# Altium schematic sheet power.SchDoc
size A4; SheetNumber: 2; SheetTotal: 2
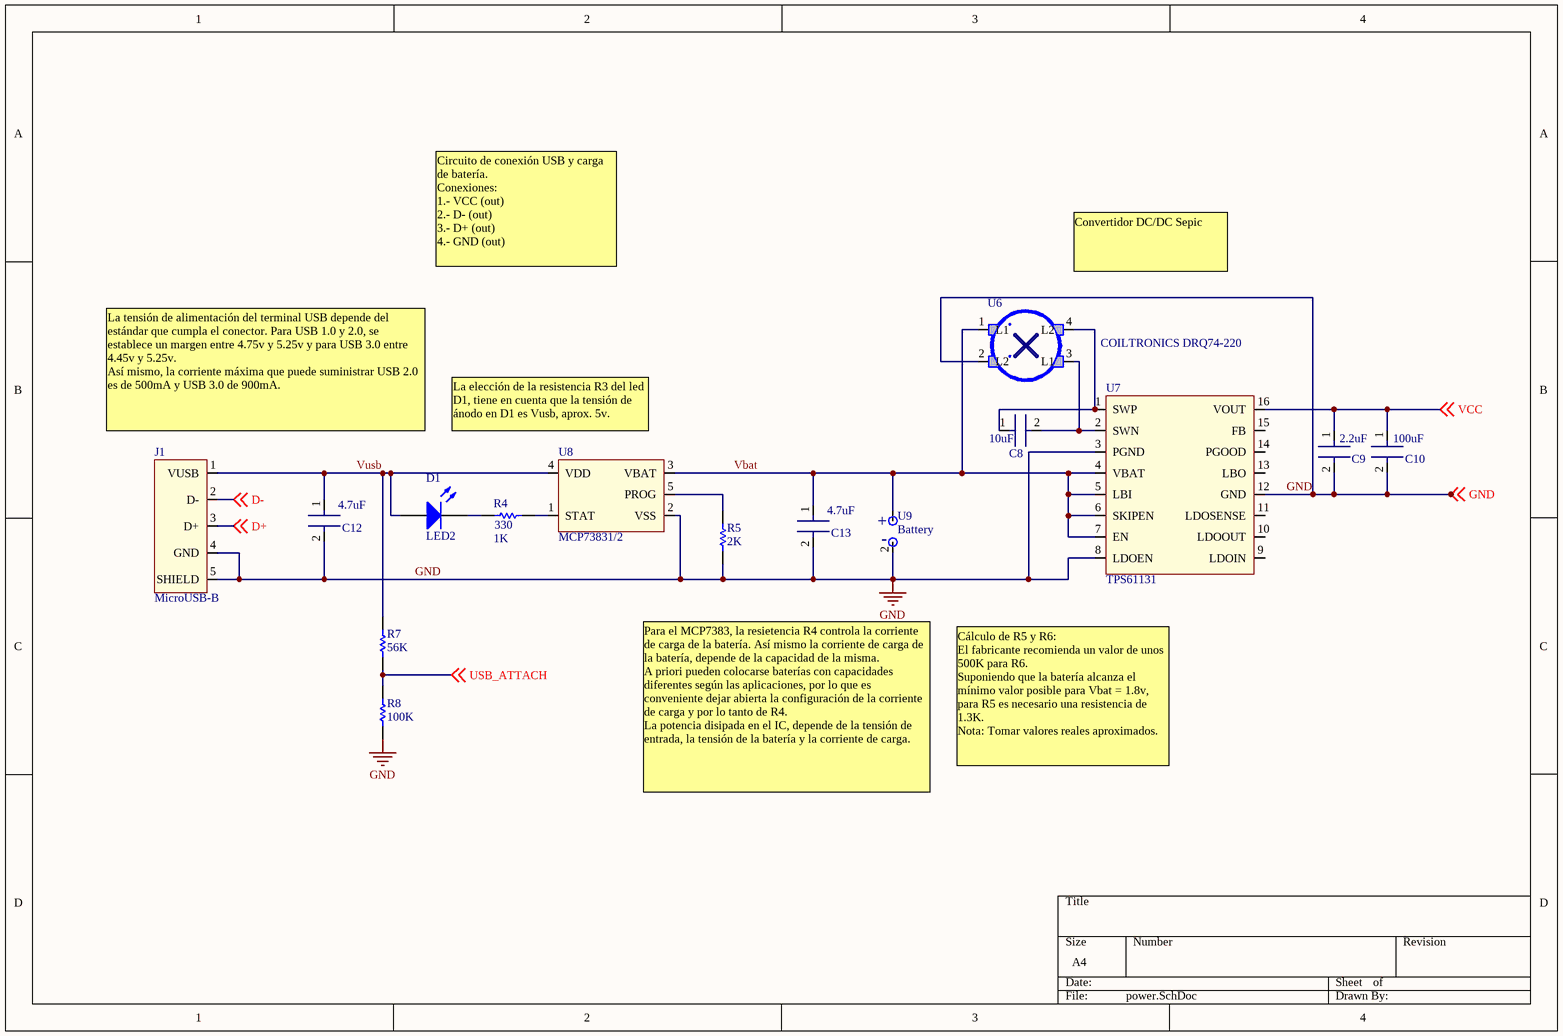
[diagram p0: power.SchDoc]

## Parts
C8  10uF  [C1206]
C9  2.2uF  [C1206]
C10  100uF  [C1206]
C12  4.7uF  [C1206]
C13  4.7uF  [C1206]
D1  LED2  [LED SMD 1206]
J1  MicroUSB-B  [Micro USB Tipo B]
R4  330  value 1K  [3216[1206]]
R5  2K  [3216[1206]]
R7  56K  [3216[1206]]
R8  100K  [3216[1206]]
U6  COILTRONICS DRQ74-220  [Trafo Flyback-SEPIC - soldadura manual]
U7  TPS61131  [TPS61131]
U8  MCP73831/2  [MCP73831]
U9  Battery  [JST PH]

## Nets
GND: C9.2 C10.2 C12.2 C13.2 J1.4(GND) J1.5(SHIELD) R5.1 R8.1 U6.2(L2) U7.3(PGND) U7.8(LDOEN) U7.12(GND) U8.2(VSS) U9.2 ; off-sheet GND
D+: J1.3(D+) ; off-sheet D+
D-: J1.2(D-) ; off-sheet D-
USB_ATTACH: R7.1 R8.2 ; off-sheet USB_ATTACH
Vbat: C13.1 U6.1(L1) U7.4(VBAT) U7.5(LBI) U7.6(SKIPEN) U7.7(EN) U8.3(VBAT) U9.1
VCC: C9.1 C10.1 U7.16(VOUT) ; off-sheet VCC
Vusb: C12.1 D1.1(A) J1.1(VUSB) R7.2 U8.4(VDD)
NetC8_1: C8.1 U6.4(L2) U7.1(SWP)
NetC8_2: C8.2 U6.3(L1) U7.2(SWN)
NetD1_2: D1.2(K) R4.1
NetR4_2: R4.2 U8.1(STAT)
NetR5_2: R5.2 U8.5(PROG)

Not connected (* = marked no-connect by the designer): U7 9(LDOIN) 10(LDOOUT) 11(LDOSENSE) 13(LBO) 14(PGOOD) 15(FB)

## Notes on the sheet
- Circuito de conexión USB y carga de batería.
  Conexiones:
  1.- VCC (out)
  2.- D- (out)
  3.- D+ (out)
  4.- GND (out)
- Convertidor DC/DC Sepic
- (near J1) La tensión de alimentación del terminal USB depende del estándar que cumpla el conector. Para USB 1.0 y 2.0, se establece un margen entre 4.75v y 5.25v y para USB 3.0 entre 4.45v y 5.25v.
  Así mismo, la corriente máxima que puede suministrar USB 2.0 es de 500mA y USB 3.0 de 900mA.
- (near U8) La elección de la resistencia R3 del led D1, tiene en cuenta que la tensión de ánodo en D1 es Vusb, aprox. 5v.
- Para el MCP7383, la resietencia R4 controla la corriente de carga de la batería. Así mismo la corriente de carga de la batería, depende de la capacidad de la misma.
  A priori pueden colocarse baterías con capacidades diferentes según las aplicaciones, por lo que es conveniente dejar abierta la configuración de la corriente de carga y por lo tanto de R4.
  La potencia disipada en el IC, depende de la tensión de entrada, la tensión de la batería y la corriente de carga.
- Cálculo de R5 y R6:
  El fabricante recomienda un valor de unos 500K para R6.
  Suponiendo que la batería alcanza el mínimo valor posible para Vbat = 1.8v,
  para R5 es necesario una resistencia de 1.3K.
  Nota: Tomar valores reales aproximados.
- (in symbol Battery) +; -

## Library data of the parts
C8-C10 C12 C13 = TDK C3216X7R1C106K
D1 = LED2: Typical RED, GREEN, YELLOW, AMBER GaAs LED; Published: 8-Jun-2000; LatestRevisionDate: 17-Jul-2002; LatestRevisionNote: Re-released for DXP Platform.; PackageDocument: Feb-2002; PackageReference: 3.2X1.6X1.1; Publisher: Altium Limited
R4 R5 = Res Semi: Semiconductor Resistor; Published: 8-Jun-2000; LatestRevisionDate: 17-Jul-2002; LatestRevisionNote: Re-released for DXP Platform.; PackageReference: AXIAL-0.5; Publisher: Altium Limited
R7 R8 = Res Semi: Semiconductor Resistor; Value: 1K; Published: 8-Jun-2000; LatestRevisionDate: 17-Jul-2002; LatestRevisionNote: Re-released for DXP Platform.; PackageReference: AXIAL-0.5; Publisher: Altium Limited; PackageDescription: Axial Device, Thru-Hole; 2 Leads; 0.5 in Pin Spacing